# EAGLE design lpc_boilerplate (EAGLE 5.10)
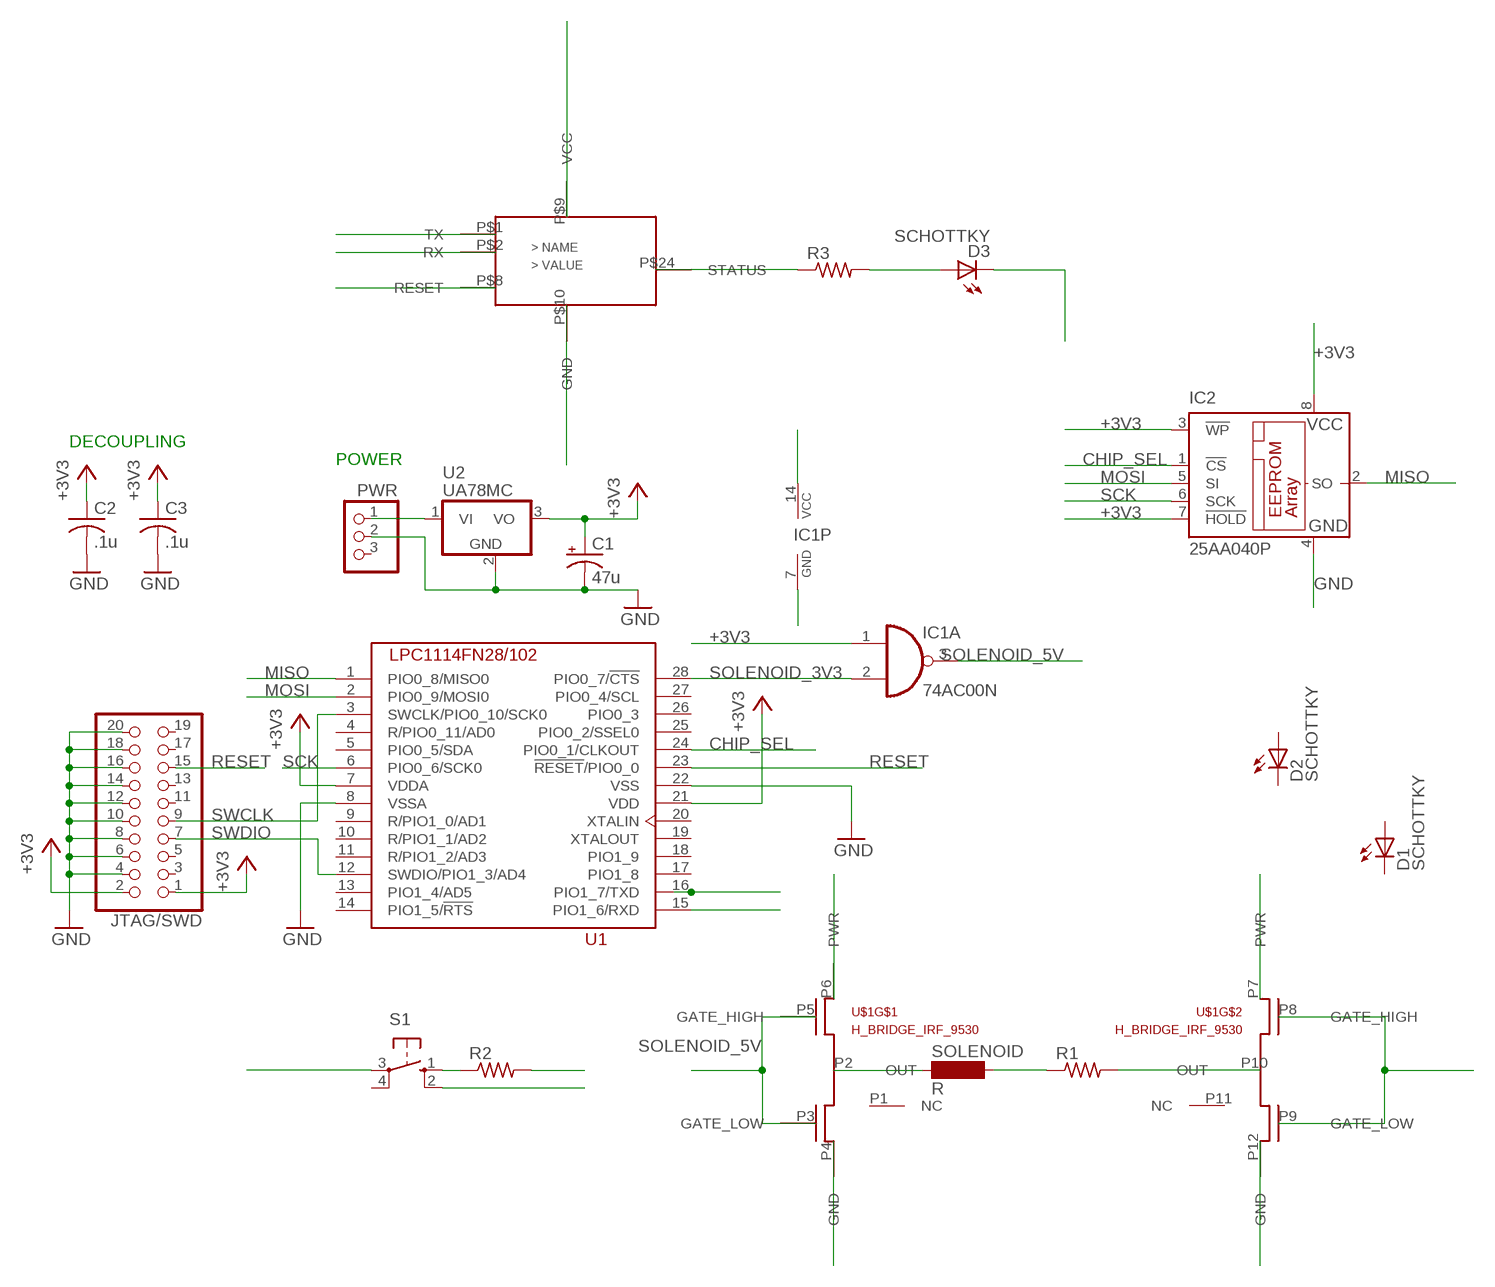
[diagram p0: schematic, sheet 1]

## Parts
C1  47u  CPOL-USE3.5-8  [E3,5-8]
C2  .1u  C-US050-024X044  [C050-024X044]
C3  .1u  C-US050-024X044  [C050-024X044]
D1  SCHOTTKY  LED3MM  [LED3MM]
D2  SCHOTTKY  LED3MM  [LED3MM]
D3  SCHOTTKY  LED3MM  [LED3MM]
IC1  74AC00N  [DIL14]
IC2  25AA040P  [DIL8]
JTAG/SWD  PINHD-2X10  [2X10]
PWR  PINHD-1X3  [1X03]
R1  R-US_0207/7  [0207/7]
R2  R-US_0207/7  [0207/7]
R3  R-US_0207/7  [0207/7]
S1  10-XX  [B3F-10XX]
SOLENOID  R  SD75  [SD75]
U1  LPC1114FN28/102  [DIL28-6]
U2  UA78MC  [TO220V]
U$1  H_BRIDGE_IRF_9530  [PSEUDO_SIP12]
U$2  BLUETOOTH_DEVICE  [BLUETOOTH_PACKAGE]

## Nets
+3V3: C1.+ C2.1 C3.1 IC1.1(A:I0) IC2.3(!WP) IC2.7(!HOLD) IC2.8(VCC) JTAG/SWD.1 JTAG/SWD.2 R2.2 U1.7(VDDA) U1.21(VDD) U2.3(VO) U$1.P6(PWR) U$2.P$9(VCC)
+5V: IC1.14(P:VCC) PWR.1 U2.1(VI) U$1.P7(PWR)
CHIP_SEL: IC2.1(!CS) U1.24(PIO0_1/CLKOUT)
GND: C1.- C2.2 C3.2 D3.K(C) IC1.7(P:GND) IC2.4(GND) JTAG/SWD.4 JTAG/SWD.6 JTAG/SWD.8 JTAG/SWD.10 JTAG/SWD.12 JTAG/SWD.14 JTAG/SWD.16 JTAG/SWD.18 JTAG/SWD.20 PWR.2 S1.3(P) U1.8(VSSA) U1.22(VSS) U2.2(GND) U$1.P4(GND) U$1.P8(GATE_HIGH) U$1.P9(GATE_LOW) U$1.P12(GND) U$2.P$10(GND)
H_GND: R1.2 U$1.P10(OUT)
MISO: IC2.2(SO) U1.1(PIO0_8/MISO0)
MOSI: IC2.5(SI) U1.2(PIO0_9/MOSI0)
N$1: R2.1 S1.1(S)
N$2: R1.1 SOLENOID.2
N$3: D3.A R3.2
N$6: SOLENOID.1 U$1.P2(OUT)
RESET: JTAG/SWD.15 S1.2(S1) U1.23(!RESET!/PIO0_0) U$2.P$8(RESET)
RXD: U1.15(PIO1_6/RXD) U$2.P$1(TX)
SCK: IC2.6(SCK) U1.6(PIO0_6/SCK0)
SOLENOID_3V3: IC1.2(A:I1) U1.28(PIO0_7/!CTS)
SOLENOID_5V: IC1.3(A:O) U$1.P3(GATE_LOW) U$1.P5(GATE_HIGH)
STATUS: R3.1 U$2.P$24(STATUS)
SWCLK: JTAG/SWD.9 U1.3(SWCLK/PIO0_10/SCK0)
SWDIO: JTAG/SWD.7 U1.12(SWDIO/PIO1_3/AD4)
TXD: U1.16(PIO1_7/TXD) U$2.P$2(RX)
Unconnected: D1.A D1.K(C) D2.A D2.K(C) IC1.4(B:I0) IC1.5(B:I1) IC1.6(B:O) IC1.8(C:O) IC1.9(C:I0) IC1.10(C:I1) IC1.11(D:O) IC1.12(D:I0) IC1.13(D:I1) JTAG/SWD.3 JTAG/SWD.5 JTAG/SWD.11 JTAG/SWD.13 JTAG/SWD.17 JTAG/SWD.19 PWR.3 S1.4(P1) U1.4(R/PIO0_11/AD0) U1.5(PIO0_5/SDA) U1.9(R/PIO1_0/AD1) U1.10(R/PIO1_1/AD2) U1.11(R/PIO1_2/AD3) U1.13(PIO1_4/AD5) U1.14(PIO1_5/!RTS) U1.17(PIO1_8) U1.18(PIO1_9) U1.19(XTALOUT) U1.20(XTALIN) U1.25(PIO0_2/SSEL0) U1.26(PIO0_3) U1.27(PIO0_4/SCL) U$1.P1(NC) U$1.P11(NC)

## Notes on the sheet
- DECOUPLING
- POWER

## Library data of the parts
C1 = rcl:CPOL-US: POLARIZED CAPACITOR, American symbol
C2 C3 = rcl:C-US: CAPACITOR, American symbol
D1-D3 = led:LED: LED OSRAM: - CHIPLED LG R971, LG N971, LY N971, LG Q971, LY Q971, LO R971, LY R971 LH N974, LH R974 LS Q976, LO Q976, LY Q976 LO Q996 - Hyper CHIPLED LW Q18S LB Q993, LB Q99A, LB R99A - SideLED LS A670, LO A670, LY A670, LG A670, LP A670 LB A673, LV A673, LT A673, LW A673 LH A674 LY A675 LS A676, LA A676, LO A676, LY A676, LW A676 LS A679, LY A679, LG A679 - Hyper Micro SIDELED® LS Y876, LA Y876, LO Y876, LY Y876 LT Y87S - SmartLED LW L88C, LW L88S LB L89C, LB L89S, LG L890 LS L89K, LO L89K, LY L89K LS L896, LA L896, LO L896, LY L896 - TOPLED LS T670, LO T670, LY T670, LG T670, LP T670 LSG T670, LSP T670, LSY T670, LOP T670, LYG T670 LG T671, LOG T671, LSG T671 LB T673, LV T673, LT T673, LW T673 LH T674 LS T676, LA T676, LO T676, LY T676, LB T676, LH T676, LSB T676, LW T676 LB T67C, LV T67C, LT T67C, LS T67K, LO T67K, LY T67K, LW E67C LS E67B, LA E67B, LO E67B, LY E67B, LB E67C, LV E67C, LT E67C LW T67C LS T679, LY T679, LG T679 LS T770, LO T770, LY T770, LG T770, LP T770 LB T773, LV T773, LT T773, LW T773 LH T774 LS E675, LA E675, LY E675, LS T675 LS T776, LA T776, LO T776, LY T776, LB T776 LHGB T686 LT T68C, LB T68C - Hyper Mini TOPLED® LB M676 - Mini TOPLED Santana® LG M470 LS M47K, LO M47K, LY M47K Source: http://www.osram.convergy.de LUXEON: - LUMILED® LXK2-PW12-R00, LXK2-PW12-S00, LXK2-PW14-U00, LXK2-PW14-V00 LXK2-PM12-R00, LXK2-PM12-S00, LXK2-PM14-U00 LXK2-PE12-Q00, LXK2-PE12-R00, LXK2-PE12-S00, LXK2-PE14-T00, LXK2-PE14-U00 LXK2-PB12-K00, LXK2-PB12-L00, LXK2-PB12-M00, LXK2-PB14-N00, LXK2-PB14-P00, LXK2-PB14-Q00 LXK2-PR12-L00, LXK2-PR12-M00, LXK2-PR14-Q00, LXK2-PR14-R00 LXK2-PD12-Q00, LXK2-PD12-R00, LXK2-PD12-S00 LXK2-PH12-R00, LXK2-PH12-S00 LXK2-PL12-P00, LXK2-PL12-Q00, LXK2-PL12-R00 Source: www.luxeon.com KINGBRIGHT: KA-3528ASYC Source: www.kingbright.com
IC1 = 74xx-eu:74*00: Quad 2-input NAND gate
IC2 = microchip:25*: Serial EEPROM 4K/ 8K , SPI bus
JTAG/SWD = pinhead:PINHD-2X10: PIN HEADER
PWR = pinhead:PINHD-1X3: PIN HEADER
R1-R3 = rcl:R-US_: RESISTOR, American symbol
S1 = switch-omron:10-XX: OMRON SWITCH
SOLENOID = inductor-neosid:SD75: INDUCTOR nominal inductance, E12
U1 = lpc_11xx:LPC1114FN28/102
U2 = lpc_11xx:UA78M*C
U$1 = transistor-power:H_BRIDGE_IRF_9530
U$2 = transistor-power:BLUETOOTH_DEVICE

## Board
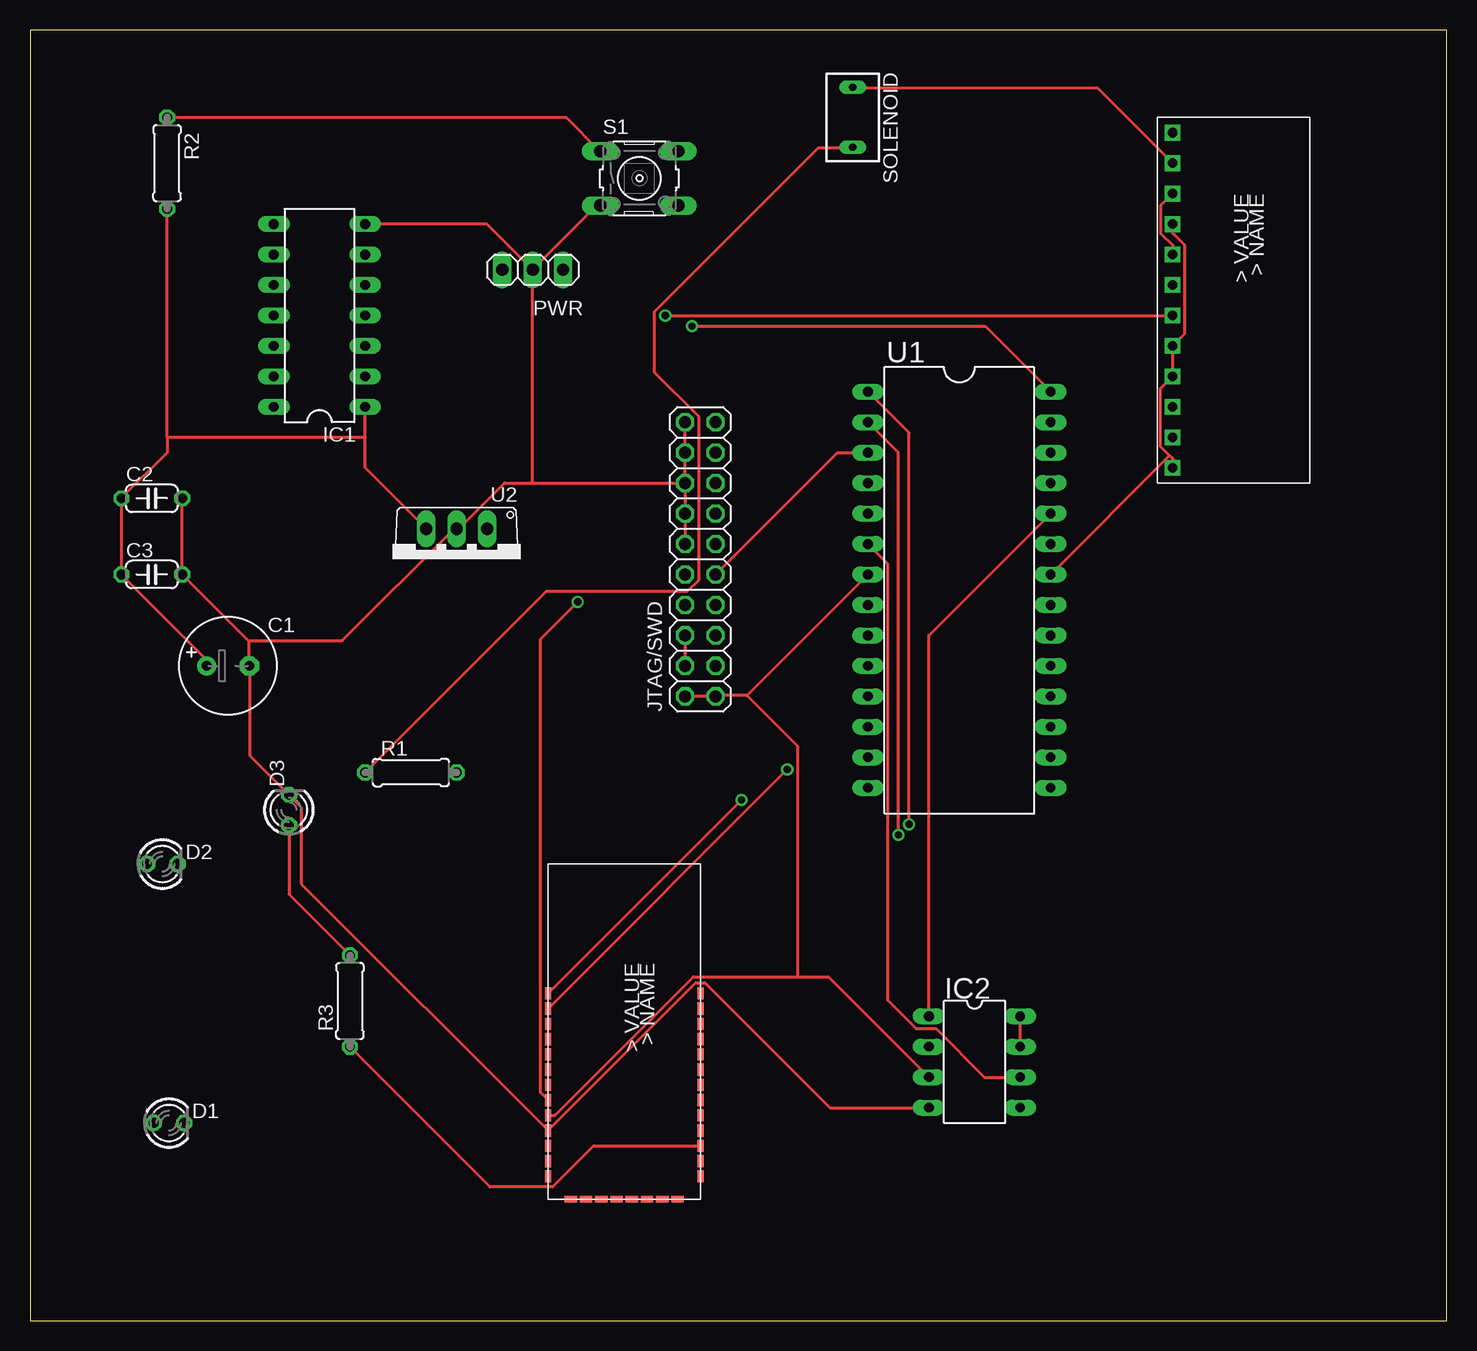
[diagram p1: board, top side]
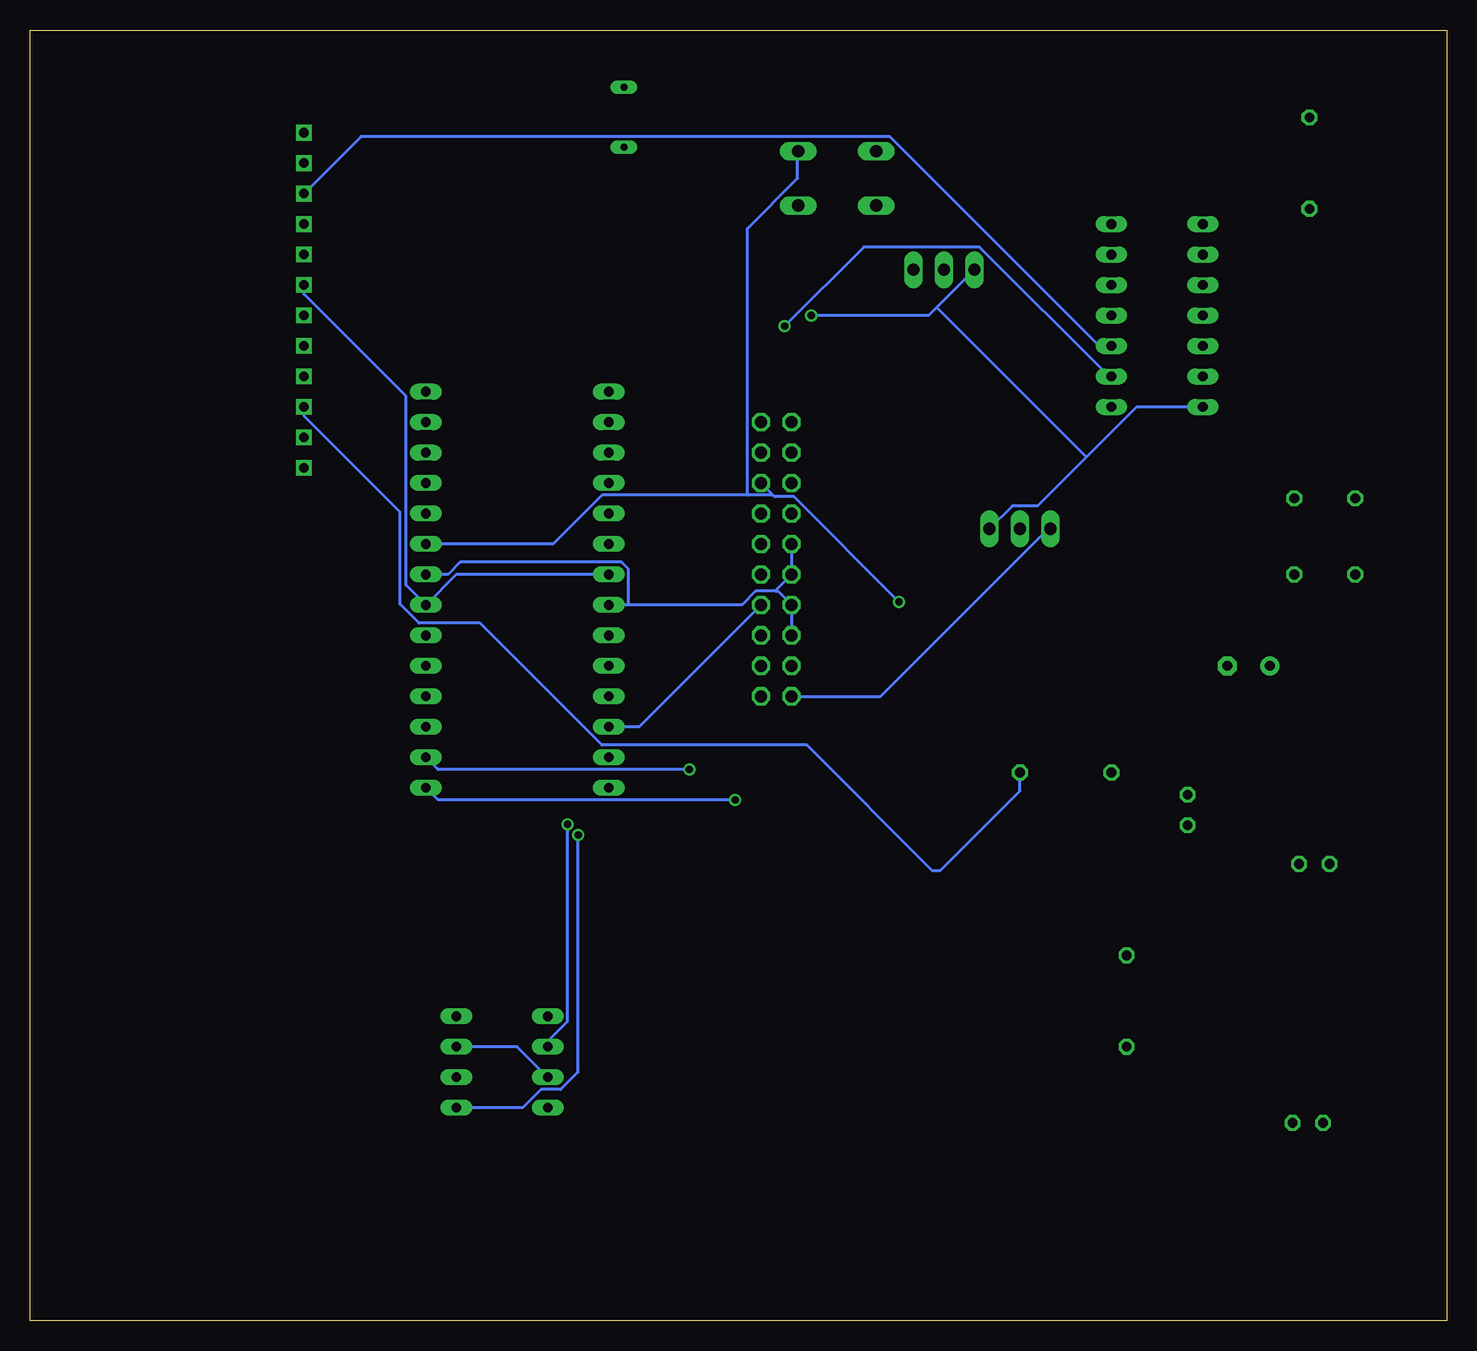
[diagram p2: board, bottom side, seen from below]

Size 118.09 x 107.62 mm. Coordinates in mm from the lower left corner, seen from the top.
Outline: 0,0 118.09,0 118.09,107.62 0,107.62 0,0
Copper layers (1*16): Top 0.035mm / dielectric 1.5mm / Bottom 0.035mm
Design rules "default": minimum track width 10mil, minimum drill 24mil, track to track 8mil, track to pad 8mil, pad to pad 8mil, via to via 8mil, smd to smd 8mil, copper to edge 40mil, drill to drill 8mil, minimum pad ring 10mil, minimum via ring 8mil, stop-mask expansion 4mil, vias tented up to drill 0mil, thermal gap 10mil
vRestrict: area 43.2,10.2 to 55.9,38.1; area 71.1,41.9 to 83.8,80; area 94,69.8 to 106.7,100.3; area 48.3,92.7 to 53.3,97.8; area 21.6,74.9 to 26.7,92.7; area 8.9,67.3 to 11.4,69.8; area 8.9,61 to 11.4,63.5; area 12.7,50.8 to 20.3,58.4; area 20.3,40.6 to 22.9,44.5; area 29.2,44.5 to 34.3,47; area 25.4,24.1 to 27.9,29.2; area 76.2,16.5 to 81.3,26.7; 5 more areas

### Footprints (pad centres in the part's own frame; a part is rotated, then mirrored left to right if it is on the bottom)
E3,5-8 = drill 0.813 pad 1.6 round: + -1.778,0 | drill 0.813 pad 1.6 octagon: - 1.778,0
C050-024X044 = drill 0.813 octagon: 1 -2.54,0; 2 2.54,0
LED3MM = drill 0.813 octagon: A -1.27,0; K 1.27,0
DIL14 = drill 0.813 long: 1 -7.62,-3.81; 2 -5.08,-3.81; 3 -2.54,-3.81; 4 0,-3.81; 5 2.54,-3.81; 6 5.08,-3.81; 7 7.62,-3.81; 8 7.62,3.81; 9 5.08,3.81; 10 2.54,3.81; 11 0,3.81; 12 -2.54,3.81; 13 -5.08,3.81; 14 -7.62,3.81
DIL8 = drill 0.813 long: 1 -3.81,-3.81; 2 -1.27,-3.81; 3 1.27,-3.81; 4 3.81,-3.81; 5 3.81,3.81; 6 1.27,3.81; 7 -1.27,3.81; 8 -3.81,3.81
2X10 = drill 1.016 octagon: 1 -11.43,-1.27; 2 -11.43,1.27; 3 -8.89,-1.27; 4 -8.89,1.27; 5 -6.35,-1.27; 6 -6.35,1.27; 7 -3.81,-1.27; 8 -3.81,1.27; 9 -1.27,-1.27; 10 -1.27,1.27; 11 1.27,-1.27; 12 1.27,1.27; 13 3.81,-1.27; 14 3.81,1.27; 15 6.35,-1.27; 16 6.35,1.27; 17 8.89,-1.27; 18 8.89,1.27; 19 11.43,-1.27; 20 11.43,1.27
1X03 = drill 1.016 long: 1 -2.54,0; 2 0,0; 3 2.54,0
0207/7 = drill 0.813 octagon: 1 -3.81,0; 2 3.81,0
B3F-10XX = drill 1.016 long: 1 -3.251,2.261; 2 3.251,2.261; 3 -3.251,-2.261; 4 3.251,-2.261
SD75 = drill 0.6 long: 1 -2.5,0; 2 2.5,0
DIL28-6 = drill 0.813 long: 1 -16.51,-7.62; 2 -13.97,-7.62; 3 -11.43,-7.62; 4 -8.89,-7.62; 5 -6.35,-7.62; 6 -3.81,-7.62; 7 -1.27,-7.62; 8 1.27,-7.62; 9 3.81,-7.62; 10 6.35,-7.62; 11 8.89,-7.62; 12 11.43,-7.62; 13 13.97,-7.62; 14 16.51,-7.62; 15 16.51,7.62; 16 13.97,7.62; 17 11.43,7.62; 18 8.89,7.62; 19 6.35,7.62; 20 3.81,7.62; 21 1.27,7.62; 22 -1.27,7.62; 23 -3.81,7.62; 24 -6.35,7.62; 25 -8.89,7.62; 26 -11.43,7.62; 27 -13.97,7.62; 28 -16.51,7.62
TO220V = drill 1.016 long: 1 -2.54,-2.54; 2 0,-2.54; 3 2.54,-2.54
PSEUDO_SIP12 = drill 0.8 square: P1 -15.24,0; P2 -12.7,0; P3 -10.16,0; P4 -7.62,0; P5 -5.08,0; P6 -2.54,0; P7 0,0; P8 2.54,0; P9 5.08,0; P10 7.62,0; P11 10.16,0; P12 12.7,0
BLUETOOTH_PACKAGE = smd 1.016 x 0.508: P$1 -1.905,-1.27; P$2 -0.635,-1.27; P$3 0.635,-1.27; P$4 1.905,-1.27; P$5 3.175,-1.27; P$6 4.445,-1.27; P$7 5.715,-1.27; P$8 6.985,-1.27; P$9 8.255,-1.27; P$10 9.525,-1.27; P$11 10.795,-1.27; P$12 12.065,-1.27; P$13 13.335,-1.27; P$22 13.335,11.43; P$23 12.065,11.43; P$24 10.795,11.43; P$25 9.525,11.43; P$26 8.255,11.43; P$27 6.985,11.43; P$28 5.715,11.43; P$29 4.445,11.43; P$30 3.175,11.43; P$31 1.905,11.43; P$32 0.635,11.43; P$33 -0.635,11.43; P$34 -1.905,11.43 | smd 0.508 x 1.016: P$14 15.24,0.635; P$15 15.24,1.905; P$16 15.24,3.175; P$17 15.24,4.445; P$18 15.24,5.715; P$19 15.24,6.985; P$20 15.24,8.255; P$21 15.24,9.525

### Placement (x,y rotation side)
C1  16.51,54.61 0 top
C2  10.16,68.58 0 top
C3  10.16,62.23 0 top
D1  11.57,16.51 0 top
D2  11.03,38.1 0 top
D3  21.59,42.6 90 top
IC1  24.13,83.82 90 top
IC2  78.74,21.59 270 top
JTAG/SWD  55.88,63.5 90 top
PWR  41.91,87.63 0 top
R1  31.75,45.72 0 top
R2  11.43,96.52 270 top
R3  26.67,26.67 90 top
S1  50.8,95.25 0 top
SOLENOID  68.58,100.34 270 top
U1  77.47,60.96 270 top
U2  35.56,63.5 180 top
U$1  95.25,83.82 270 top
U$2  44.45,25.4 270 top

### Tracks (layer width: path | path; a pad name or v marks a point on that pad's centre or on a via)
+3V3
  Top 0.254: 27.94,73.66 27.94,71.12 U2.3 | 27.94,73.66 IC1.1 | 11.43,73.66 11.43,72.39 C2.1 C3.1 14.73,55.12 C1.+ | 11.43,73.66 R2.2 | 27.94,73.66 11.43,73.66 | IC2.7 IC2.8 | U$2.P$9 43.75,17.15 55.31,28.7 64.01,28.7 | 64.01,28.7 66.55,28.7 IC2.3 | JTAG/SWD.2 JTAG/SWD.1 57.21,52.13 59.75,52.13 | 59.75,52.13 U1.7 | 64.01,28.7 64.01,47.88 59.75,52.13
  Bottom 0.254: IC2.7 77.47,22.86 IC2.3 | U$1.P6 95.25,85.6 86.74,77.09 86.74,61.34 U1.21 82.55,62.23 U1.7 | U2.3 33.21,66.04 47.18,52.07 JTAG/SWD.2
+5V  (via drill 0.61)
  Top 0.254: v52.96,83.82 U$1.P7
  Bottom 0.254: IC1.14 25.84,76.2 30.04,72.01 | 30.04,72.01 34.1,67.94 36.2,67.94 U2.1 | v52.96,83.82 43.18,83.82 42.51,84.49 | 42.51,84.49 PWR.1 | 30.04,72.01 42.48,84.45 42.51,84.49
CHIP_SEL
  Top 0.254: IC2.1 74.93,57.15 U1.24
GND
  Top 0.254: U$1.P12 95.25,71.88 95,72.14 | 95,72.14 94.23,72.9 94.23,77.72 U$1.P9 U$1.P8 96.27,82.3 96.27,89.66 95.25,90.68 U$1.P4 | U1.22 95,72.14 | JTAG/SWD.6 JTAG/SWD.4 | IC1.7 38.1,91.44 PWR.2 | S1.3 47.5,92.96 47.24,92.96 PWR.2 | 41.91,69.85 JTAG/SWD.16 | 41.91,69.85 39.56,69.85 35.75,66.04 U2.2 35.5,65.98 35.31,65.98 26.04,56.7 18.35,56.7 18.29,56.64 | JTAG/SWD.16 JTAG/SWD.14 JTAG/SWD.12 | JTAG/SWD.16 JTAG/SWD.18 JTAG/SWD.20 | 41.91,69.85 PWR.2 | C2.2 C3.2 18.29,56.64 | 18.29,56.64 C1.- 18.35,54.55 18.35,47.12 21.53,43.94 D3.K 21.59,43.81 22.61,42.8 22.61,36.45 U$2.P$10 55.5,28.19 56.26,28.19 66.68,17.78 IC2.4
  Bottom 0.254: 68.2,59.69 58.74,59.69 57.59,60.83 55.94,60.83 | 68.2,59.69 U1.8 | 55.94,60.83 55.75,60.83 JTAG/SWD.8 JTAG/SWD.6 | 55.94,60.83 55.94,60.9 JTAG/SWD.10 JTAG/SWD.12 | U1.22 83.25,62.23 82.23,63.25 68.77,63.25 68.2,62.67 68.2,59.69
H_GND
  Bottom 0.254: U$1.P10 95.25,75.44 87.25,67.44 87.25,59.75 85.66,58.17 80.58,58.17 70.42,48.01 53.34,48.01 42.86,37.53 42.23,37.53 35.56,44.2 R1.2
MISO  (via drill 0.61)
  Top 0.254: v73.28,41.4 73.28,74.04 U1.1
  Bottom 0.254: IC2.2 74.93,23.3 73.28,24.96 v73.28,41.4
MOSI  (via drill 0.61)
  Top 0.254: v72.39,40.51 72.39,72.39 U1.2
  Bottom 0.254: IC2.5 77.03,17.78 75.5,19.3 73.85,19.3 72.39,20.77 v72.39,40.51
N$1
  Top 0.254: R2.1 44.7,100.33 47.5,97.54 S1.1
N$2
  Top 0.254: R1.1 43.05,60.83 54.8,60.83 55.75,61.79 55.75,75.38 52.07,79.06 52.07,84.14 65.72,97.79 68.58,97.79 SOLENOID.2
N$3
  Top 0.254: R3.2 21.59,35.56 D3.A
N$6
  Top 0.254: U$1.P2 88.96,102.81 68.58,102.81 SOLENOID.1
RESET  (via drill 0.61)
  Top 0.254: U$2.P$8 42.55,19.05 42.55,56.83 v45.66,59.94
  Bottom 0.254: v45.66,59.94 54.42,68.71 56.01,68.71 56.2,68.9 | 56.2,68.9 JTAG/SWD.15 | U1.23 74.49,64.77 70.42,68.83 58.29,68.83 | 58.29,68.83 56.26,68.83 56.2,68.9 | S1.2 54.1,97.47 54.1,95.25 58.29,91.06 58.29,68.83
RXD  (via drill 0.61)
  Top 0.254: U$2.P$1 v59.31,43.43
  Bottom 0.254: v59.31,43.43 84.07,43.43 U1.15
SCK
  Top 0.254: IC2.6 79.56,20.32 75.5,24.38 73.85,24.38 71.5,26.73 71.5,63.12 U1.6
SOLENOID_3V3  (via drill 0.61)
  Top 0.254: v55.18,82.93 79.63,82.93 U1.28
  Bottom 0.254: IC1.2 28.13,78.74 38.93,89.53 48.58,89.53 v55.18,82.93
SOLENOID_5V
  Top 0.254: U$1.P5 95.25,89.66 94.23,90.68 94.23,92.96 U$1.P3
  Bottom 0.254: IC1.3 28.96,81.28 46.42,98.74 90.49,98.74 U$1.P3
STATUS
  Top 0.254: U$2.P$24 46.99,14.61 43.56,11.18 38.35,11.18 R3.1
SWCLK
  Top 0.254: U1.3 67.31,72.39 JTAG/SWD.9
SWDIO
  Bottom 0.254: U1.12 67.31,49.53 JTAG/SWD.7
TXD  (via drill 0.61)
  Top 0.254: U$2.P$2 v63.12,45.97
  Bottom 0.254: v63.12,45.97 84.07,45.97 U1.16